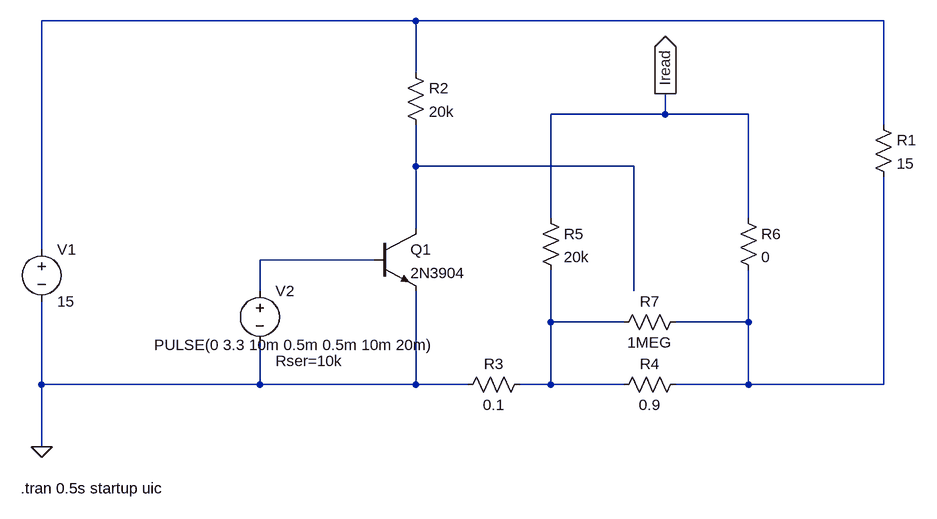
[diagram p0: schematic mosfet-bjt-switch.asc]
mosfet-bjt-switch.asc, the LTspice schematic file:
Version 4
SHEET 1 1168 680
WIRE 288 -320 -288 -320
WIRE 1008 -320 288 -320
WIRE 288 -240 288 -320
WIRE 672 -176 672 -208
WIRE 672 -176 496 -176
WIRE 800 -176 672 -176
WIRE 1008 -160 1008 -320
WIRE 288 -96 288 -160
WIRE 624 -96 288 -96
WIRE 496 -16 496 -176
WIRE 800 -16 800 -176
WIRE 288 0 288 -96
WIRE -288 32 -288 -320
WIRE 224 48 48 48
WIRE 48 96 48 48
WIRE 624 96 624 -96
WIRE 496 144 496 64
WIRE 608 144 496 144
WIRE 800 144 800 64
WIRE 800 144 688 144
WIRE -288 240 -288 112
WIRE 48 240 48 176
WIRE 48 240 -288 240
WIRE 288 240 288 96
WIRE 288 240 48 240
WIRE 368 240 288 240
WIRE 496 240 496 144
WIRE 496 240 448 240
WIRE 608 240 496 240
WIRE 800 240 800 144
WIRE 800 240 688 240
WIRE 1008 240 1008 -80
WIRE 1008 240 800 240
WIRE -288 336 -288 240
FLAG -288 336 0
FLAG 672 -208 Iread
IOPIN 672 -208 Out
SYMBOL npn 224 0 R0
SYMATTR InstName Q1
SYMATTR Value 2N3904
SYMBOL voltage -288 16 R0
WINDOW 123 0 0 Left 2
WINDOW 39 24 124 Left 2
SYMATTR InstName V1
SYMATTR Value 15
SYMBOL voltage 48 80 R0
WINDOW 123 0 0 Left 2
WINDOW 39 24 124 Left 2
WINDOW 3 -163 99 Left 2
SYMATTR SpiceLine Rser=10k
SYMATTR InstName V2
SYMATTR Value PULSE(0 3.3 10m 0.5m 0.5m 10m 20m)
SYMBOL res 992 -176 R0
SYMATTR InstName R1
SYMATTR Value 15
SYMBOL res 272 -256 R0
SYMATTR InstName R2
SYMATTR Value 20k
SYMBOL res 464 224 R90
WINDOW 0 0 56 VBottom 2
WINDOW 3 32 56 VTop 2
SYMATTR InstName R3
SYMATTR Value 0.1
SYMBOL res 704 224 R90
WINDOW 0 0 56 VBottom 2
WINDOW 3 32 56 VTop 2
SYMATTR InstName R4
SYMATTR Value 0.9
SYMBOL res 480 -32 R0
SYMATTR InstName R5
SYMATTR Value 20k
SYMBOL res 784 -32 R0
SYMATTR InstName R6
SYMATTR Value 0
SYMBOL res 704 128 R90
WINDOW 0 0 56 VBottom 2
WINDOW 3 32 56 VTop 2
SYMATTR InstName R7
SYMATTR Value 1MEG
TEXT -320 400 Left 2 !.tran 0.5s startup uic

The netlist it stands for:
* mosfet-bjt-switch.asc
Q1 N002 N003 0 0 2N3904
V1 N001 0 15
V2 N003 0 PULSE(0 3.3 10m 0.5m 0.5m 10m 20m) Rser=10k
R1 N001 N005 15
R2 N001 N002 20k
R3 N004 0 0.1
R4 N005 N004 0.9
R5 Iread N004 20k
R6 Iread N005 0
R7 N005 N004 1MEG
.model NPN NPN
.model PNP PNP
.lib standard.bjt
.tran 0.5s startup uic
.backanno
.end